# Altium schematic sheet IC - Buffer.SchDoc
size A4; SheetNumber: 28; SheetTotal: 36
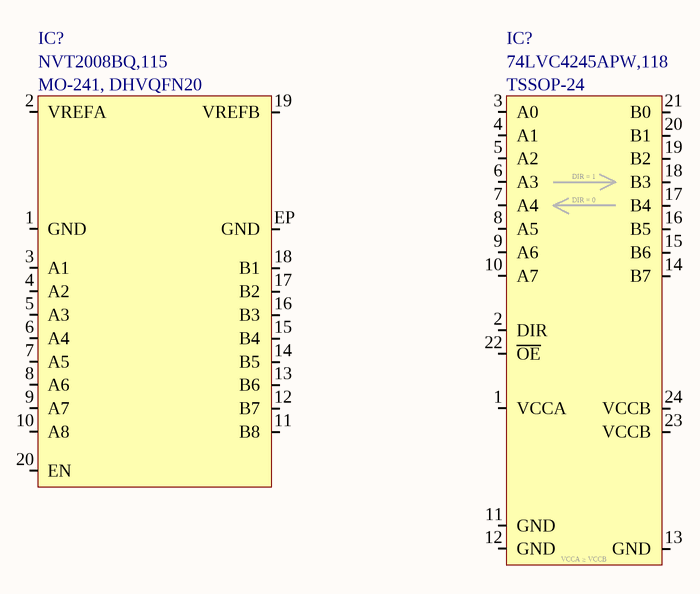
[diagram p0: IC - Buffer.SchDoc]

## Parts
(Parts that share a designator on the sheet are numbered #1, #2 ... from top to bottom, then left to right.)
IC?#1  Manufacturer Part Number: NVT2008BQ,115  [MO-241, DHVQFN20]  (hidden comment: Nexperia, NVT2008BQ)
IC?#2  Manufacturer Part Number: 74LVC4245APW,118  [TSSOP-24]  (hidden comment: Nexperia, 74LVC4245A)

## Nets

Not connected (* = marked no-connect by the designer): IC?#1 1(GND) 2(VREFA) 3(A1) 4(A2) 5(A3) 6(A4) 7(A5) 8(A6) 9(A7) 10(A8) 11(B8) 12(B7) 13(B6) 14(B5) 15(B4) 16(B3) 17(B2) 18(B1) 19(VREFB) 20(EN) EP(GND); IC?#2 1(VCCA) 2(DIR) 3(A0) 4(A1) 5(A2) 6(A3) 7(A4) 8(A5) 9(A6) 10(A7) 11(GND) 12(GND) 13(GND) 14(B7) 15(B6) 16(B5) 17(B4) 18(B3) 19(B2) 20(B1) 21(B0) 22(~{OE}) 23(VCCB) 24(VCCB)

## Notes on the sheet
- (in symbol Nexperia, 74LVC4245A) DIR = 1; DIR = 0; VCCA ≥ VCCB

## Library data of the parts
IC?#1 = Nexperia, NVT2008BQ: IC, Buffer, MO-241, DHVQFN20; ComponentLink1Description: Datasheet; ComponentLink1URL: E:\Altium\Datasheets\IC - Buffer\Nexperia, NVT2008, NVT2010.pdf; ComponentLink2Description: Supplier Link; ComponentLink2URL: https://www.digikey.com/en/products/detail/nxp-usa-inc/NVT2008BQ-115/2530654; Supplier: Digikey; Supplier Part Number: 568-5538-1-ND; Manufacturer: Nexperia; Operating Temperature, Min: -40℃; Operating Temperature, Max: +85℃; Quantity, Min: 1; Quantity, Max: 3000; Price, Min: 0.56589; Supplier Currency: $; Price, Max: 1.18; Supplier Link: https://www.digikey.com/en/products/detail/nxp-usa-inc/NVT2008BQ-115/2530654; Component Type: Buffer; Component Category: IC; Package: MO-241, DHVQFN20
IC?#2 = Nexperia, 74LVC4245A: IC, Buffer, TSSOP-24; ComponentLink1Description: Datasheet; ComponentLink1URL: E:\Altium\Datasheets\IC - Buffer\Nexperia, 74LVC4245A.pdf; ComponentLink2Description: Supplier Link; ComponentLink2URL: https://www.digikey.com/en/products/detail/nexperia-usa-inc/74LVC4245APW-118/1231659; Supplier: Digikey; Supplier Part Number: 1727-4308-1-ND; Manufacturer: Nexperia; Operating Temperature, Min: -40℃; Operating Temperature, Max: +125℃; Quantity, Min: 1; Quantity, Max: 5000; Price, Min: 0.34185; Supplier Currency: $; Price, Max: 0.91; Supplier Link: https://www.digikey.com/en/products/detail/nexperia-usa-inc/74LVC4245APW-118/1231659; Component Type: Buffer; Component Category: IC; Package: TSSOP-24